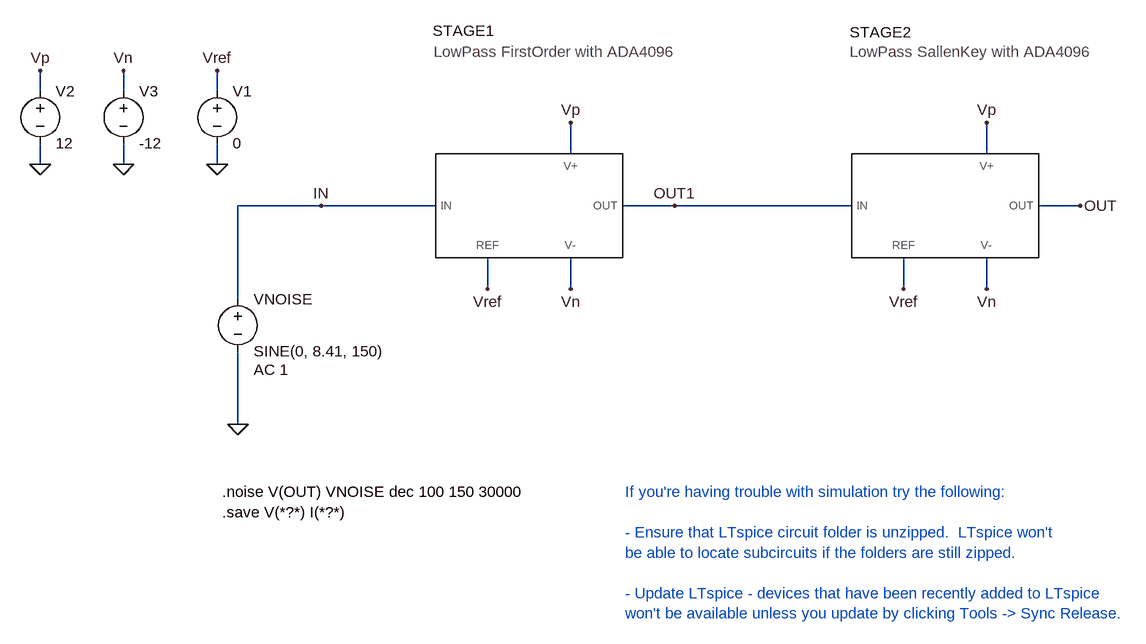
[diagram p0: schematic NoiseAnalysis.asc]
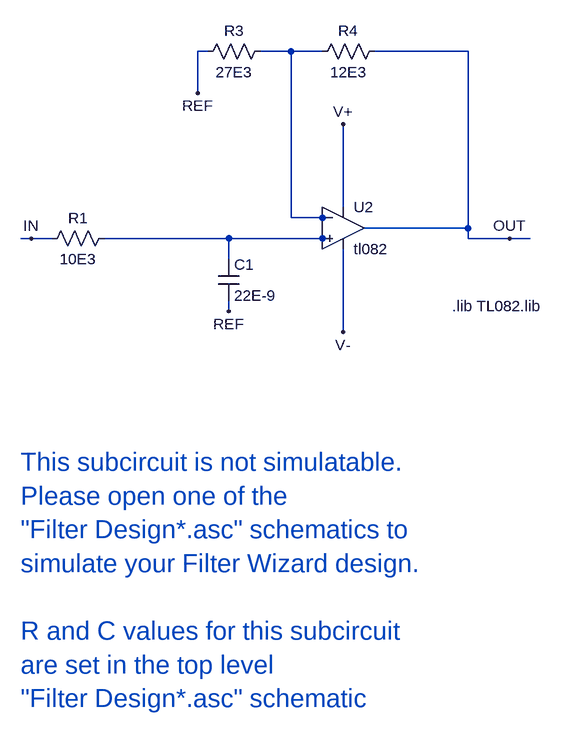
[diagram p1: sub-circuit stagea_lowpassfirstordergain_ada4096.asc]
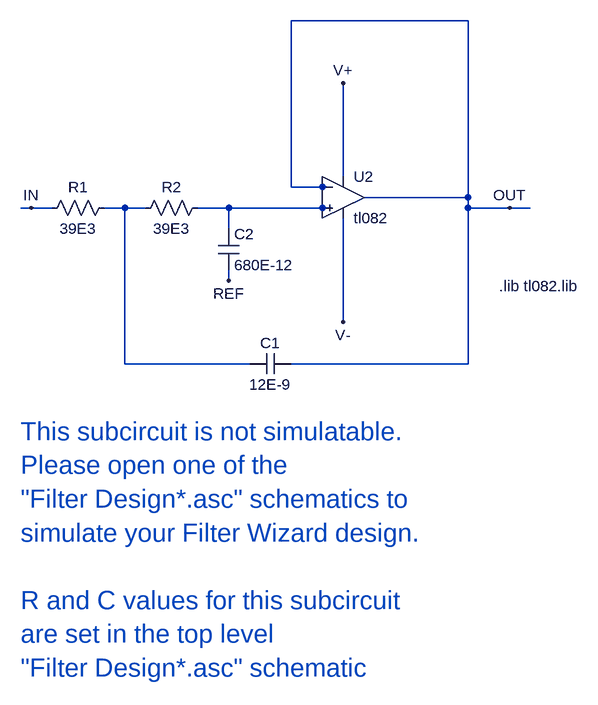
[diagram p2: sub-circuit stageb_lowpasssallenkey_ada4096.asc]
NoiseAnalysis.asc, the LTspice schematic file:
Version 4
SHEET 1 5196 728
WIRE 0 32 0 0
WIRE 128 32 128 0
WIRE 272 32 272 0
WIRE 816 128 816 80
WIRE 0 144 0 112
WIRE 128 144 128 112
WIRE 272 144 272 112
WIRE 432 208 304 208
WIRE 608 208 432 208
WIRE 976 208 896 208
WIRE 688 336 688 288
WIRE 816 336 816 288
WIRE 304 352 304 208
WIRE 304 544 304 432
FLAG 304 544 0
FLAG 0 144 0
FLAG 128 144 0
FLAG 0 0 Vp
FLAG 128 0 Vn
FLAG 816 80 Vp
FLAG 816 336 Vn
FLAG 976 208 OUT1
FLAG 272 144 0
FLAG 272 0 Vref
FLAG 688 336 Vref
FLAG 432 208 IN
SYMBOL voltage 304 336 R0
WINDOW 123 24 124 Left 2
WINDOW 39 0 0 Left 2
SYMATTR Value2 AC 1
SYMATTR InstName VNOISE

* Put Input Sine Values from design here
SYMATTR Value SINE(0, 8.41, 150)

SYMBOL voltage 0 16 R0
WINDOW 123 0 0 Left 2
WINDOW 39 0 0 Left 2
SYMATTR InstName V2

* Put Vp value from design here
SYMATTR Value 12

SYMBOL voltage 128 16 R0
WINDOW 123 0 0 Left 2
WINDOW 39 0 0 Left 2
SYMATTR InstName V3

* Put Vn value from design here
SYMATTR Value -12

SYMBOL voltage 272 16 R0
WINDOW 123 0 0 Left 2
WINDOW 39 0 0 Left 2
SYMATTR InstName V1

* Put Vref valye from design here
SYMATTR Value 0

* put subCircuit Name here
SYMBOL StageA_LowPassFirstOrderGain_ADA4096 640 160 R0
WINDOW 39 -35 -155 Left 2
WINDOW 0 -36 -221 Left 2

SYMATTR InstName STAGE1

* put start and stop frequencies from frequency response plot here
TEXT 280 648 Left 2 !.noise V(OUT) VNOISE dec 100 150 30000 \n.save V(*?*) I(*?*)

* Leave this commented out
* TEXT 280 712 Left 2 !.param Vp = 5, Vn = -5, Vref = 0
* TEXT 280 680 Left 2 !.param inputMid = 0, inputAmplitude = 2.01, inputFreq = 1E3

* Begin Stage 2
SYMBOL StageB_LowPassSallenKey_ADA4096 1280 160 R0
WINDOW 0 -35 -219 Left 2
WINDOW 39 -36 -158 Left 2
SYMATTR InstName STAGE2
WIRE 1456 128 1456 80
WIRE 1248 208 976 208
WIRE 1600 208 1536 208
WIRE 1328 336 1328 288
WIRE 1456 336 1456 288
FLAG 1600 208 OUT
FLAG 1456 80 Vp
FLAG 1456 336 Vn
FLAG 1328 336 Vref
* End Stage 2

TEXT 900 648 Left 2 ;If you're having trouble with simulation try the following:\n \n- Ensure that LTspice circuit folder is unzipped.  LTspice won't \nbe able to locate subcircuits if the folders are still zipped.\n \n- Update LTspice - devices that have been recently added to LTspice\nwon't be available unless you update by clicking Tools -> Sync Release.

stagea_lowpassfirstordergain_ada4096.asc, the sub-circuit schematic file:
Version 4
SHEET 1 4112 860
WIRE 112 -128 96 -128
WIRE 240 -128 192 -128
WIRE 288 -128 240 -128
WIRE 512 -128 368 -128
WIRE 96 -64 96 -128
WIRE 320 112 320 -16
WIRE 240 128 240 -128
WIRE 288 128 288 112
WIRE 288 128 240 128
WIRE 304 128 288 128
WIRE 512 144 512 -128
WIRE 512 144 352 144
WIRE -160 160 -176 160
WIRE -128 160 -160 160
WIRE 144 160 -48 160
WIRE 288 160 144 160
WIRE 304 160 288 160
WIRE 512 160 512 144
WIRE 576 160 512 160
WIRE 608 160 576 160
WIRE 288 176 288 160
WIRE 144 192 144 160
WIRE 144 272 144 256
WIRE 320 304 320 176
FLAG 320 -16 V+
FLAG 320 304 V-
FLAG 576 160 OUT
FLAG -160 160 IN
FLAG 144 272 REF
FLAG 96 -64 REF
SYMBOL res -32 144 R90
WINDOW 0 0 56 VBottom 2
WINDOW 3 32 56 VTop 2
SYMATTR InstName R1
SYMATTR Value 10E3
SYMBOL cap 128 192 R0
SYMATTR InstName C1
SYMATTR Value 22E-9
SYMBOL res 272 -112 R270
WINDOW 0 32 56 VTop 2
WINDOW 3 0 56 VBottom 2
SYMATTR InstName R4
SYMATTR Value 12E3
SYMBOL res 96 -112 R270
WINDOW 0 32 56 VTop 2
WINDOW 3 0 56 VBottom 2
SYMATTR InstName R3
SYMATTR Value 27E3
SYMBOL Opamps\\opamp2 320 80 R0
SYMATTR InstName U2
SYMATTR Value tl082
TEXT -176 504 Left 4 ;This subcircuit is not simulatable.  \nPlease open one of the \n"Filter Design*.asc" schematics to \nsimulate your Filter Wizard design.\n \nR and C values for this subcircuit\nare set in the top level \n"Filter Design*.asc" schematic
TEXT 488 264 Left 2 !.lib TL082.lib

stageb_lowpasssallenkey_ada4096.asc, the sub-circuit schematic file:
Version 4
SHEET 1 4112 860
WIRE 512 -128 240 -128
WIRE 320 112 320 -32
WIRE 240 128 240 -128
WIRE 288 128 288 112
WIRE 288 128 240 128
WIRE 304 128 288 128
WIRE 512 144 512 -128
WIRE 512 144 352 144
WIRE -160 160 -176 160
WIRE -128 160 -160 160
WIRE -16 160 -48 160
WIRE 16 160 -16 160
WIRE 144 160 96 160
WIRE 288 160 144 160
WIRE 512 160 512 144
WIRE 576 160 512 160
WIRE 608 160 576 160
WIRE 288 176 288 160
WIRE 144 192 144 160
WIRE 144 272 144 256
WIRE 320 336 320 176
WIRE -16 400 -16 160
WIRE 176 400 -16 400
WIRE 512 400 512 160
WIRE 512 400 240 400
FLAG 320 -32 V+
FLAG 320 336 V-
FLAG 576 160 OUT
FLAG -160 160 IN
FLAG 144 272 REF
SYMBOL res 112 144 R90
WINDOW 0 0 56 VBottom 2
WINDOW 3 32 56 VTop 2
SYMATTR InstName R2
SYMATTR Value 39E3
SYMBOL res -32 144 R90
WINDOW 0 0 56 VBottom 2
WINDOW 3 32 56 VTop 2
SYMATTR InstName R1
SYMATTR Value 39E3
SYMBOL cap 128 192 R0
SYMATTR InstName C2
SYMATTR Value 680E-12
SYMBOL cap 240 384 R90
WINDOW 0 0 32 VBottom 2
WINDOW 3 32 32 VTop 2
SYMATTR InstName C1
SYMATTR Value 12E-9
SYMBOL Opamps\\opamp2 320 80 R0
SYMATTR InstName U2
SYMATTR Value tl082
TEXT -176 504 Left 4 ;This subcircuit is not simulatable.  \nPlease open one of the \n"Filter Design*.asc" schematics to \nsimulate your Filter Wizard design.\n \nR and C values for this subcircuit\nare set in the top level \n"Filter Design*.asc" schematic
TEXT 560 280 Left 2 !.lib tl082.lib

The netlist it stands for:
* NoiseAnalysis.asc
VNOISE IN 0 SINE(0, 8.41, 150) AC 1
V2 Vp 0 12
V3 Vn 0 -12
V1 Vref 0 0
XSTAGE1 IN OUT1 Vp Vn Vref stagea_lowpassfirstordergain_ada4096
XSTAGE2 OUT1 OUT Vp Vn Vref stageb_lowpasssallenkey_ada4096

* block symbol definitions
.subckt stagea_lowpassfirstordergain_ada4096 IN OUT V+ V- REF
R1 N002 IN 10E3
C1 N002 REF 22E-9
R4 N001 OUT 12E3
R3 REF N001 27E3
XU2 N002 N001 V+ V- OUT tl082  ; pins In+ In- V+ V- OUT
* This subcircuit is not simulatable.
* Please open one of the
* "Filter Design*.asc" schematics to
* simulate your Filter Wizard design.
* R and C values for this subcircuit
* are set in the top level
* "Filter Design*.asc" schematic
.lib TL082.lib
.ends stagea_lowpassfirstordergain_ada4096

.subckt stageb_lowpasssallenkey_ada4096 IN OUT V+ V- REF
R2 N002 N001 39E3
R1 N001 IN 39E3
C2 N002 REF 680E-12
C1 OUT N001 12E-9
XU2 N002 OUT V+ V- OUT tl082  ; pins In+ In- V+ V- OUT
* This subcircuit is not simulatable.
* Please open one of the
* "Filter Design*.asc" schematics to
* simulate your Filter Wizard design.
* R and C values for this subcircuit
* are set in the top level
* "Filter Design*.asc" schematic
.lib tl082.lib
.ends stageb_lowpasssallenkey_ada4096

.noise V(OUT) VNOISE dec 100 150 30000
.save V(*?*) I(*?*)
* If you're having trouble with simulation try the following:
* - Ensure that LTspice circuit folder is unzipped.  LTspice won't
* be able to locate subcircuits if the folders are still zipped.
* - Update LTspice - devices that have been recently added to LTspice
* won't be available unless you update by clicking Tools -> Sync Release.
.backanno
.end